# EAGLE design XSensorAdapter (EAGLE 9.5.2)
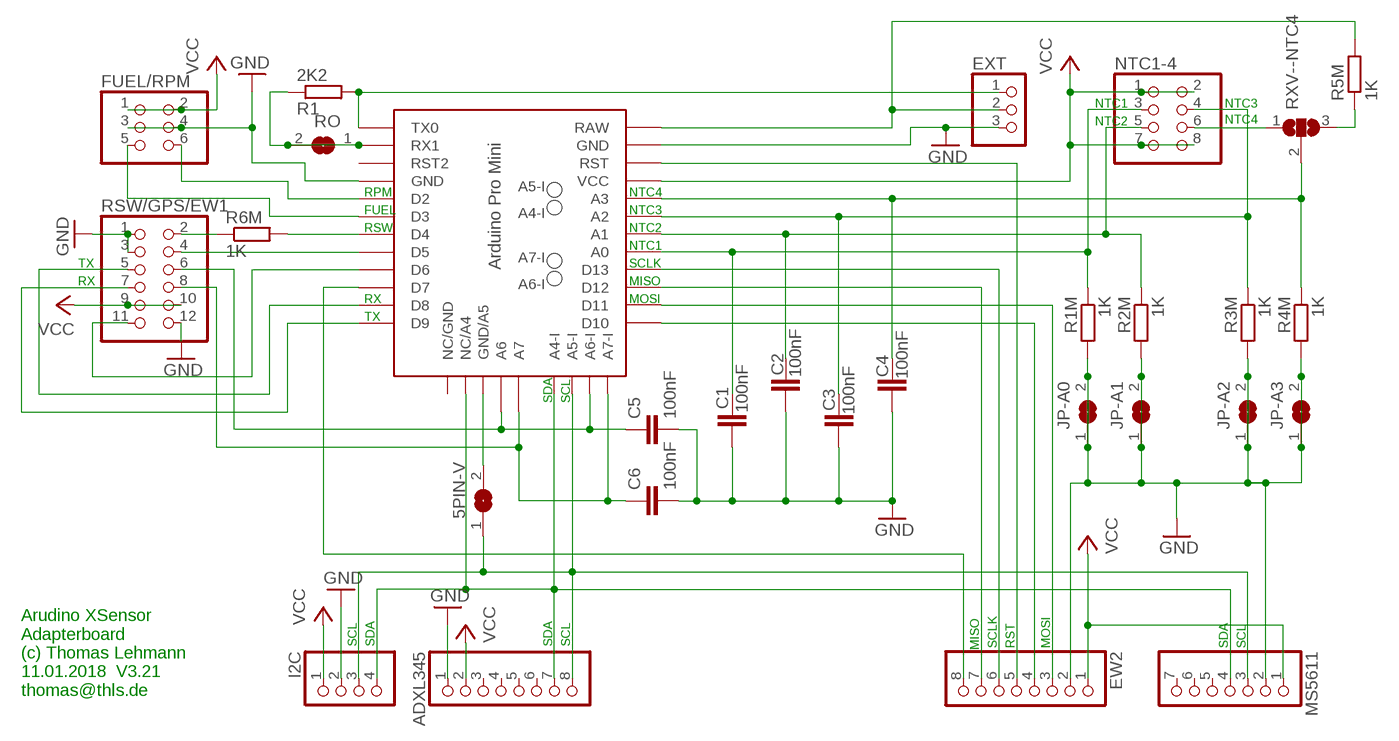
[diagram p0: schematic, sheet 1]

## Parts
5PIN-V  SJ  [SJ]
ADXL345  PINHD-1X8  [1X08]
C1  100nF  C2.5/2  [C2.5-2]
C2  100nF  C2.5/2  [C2.5-2]
C3  100nF  C2.5/2  [C2.5-2]
C4  100nF  C2.5/2  [C2.5-2]
C5  100nF  C2.5/2  [C2.5-2]
C6  100nF  C2.5/2  [C2.5-2]
EW2  PINHD-1X8  [1X08]
EXT  PINHD-1X3  [1X03]
FUEL/RPM  PINHD-2X3  [2X03]
I2C  PINHD-1X4  [1X04]
JP-A0  SJ  [SJ]
JP-A1  SJ  [SJ]
JP-A2  SJ  [SJ]
JP-A3  SJ  [SJ]
MS5611  PINHD-1X7  [1X07]
NTC1-4  PINHD-2X4  [2X04]
R1  2K2  R-EU_0207/10  [0207/10]
R1M  1K  R-EU_0207/10  [0207/10]
R2M  1K  R-EU_0207/10  [0207/10]
R3M  1K  R-EU_0207/10  [0207/10]
R4M  1K  R-EU_0207/10  [0207/10]
R5M  1K  R-EU_0207/10  [0207/10]
R6M  1K  R-EU_0207/10  [0207/10]
RO  SJ  [SJ]
RSW/GPS/EW1  PINHD-2X6  [2X06]
RXV--NTC4  SJ2W  [SJ_2]
U$1  PRO-MINI-5PINPRO-MINI-5PIN  [PRO-MINI-5PIN]

## Nets
GND: ADXL345.1 C1.2 C2.2 C3.2 C4.2 C5.2 C6.2 EW2.2 EXT.3 FUEL/RPM.3 FUEL/RPM.4 I2C.2 JP-A0.1 JP-A0.2 JP-A1.1 JP-A1.2 JP-A2.1 JP-A2.2 JP-A3.1 JP-A3.2 MS5611.2 R1M.2 R2M.2 R3M.2 R4M.2 RSW/GPS/EW1.1 RSW/GPS/EW1.3 RSW/GPS/EW1.12 U$1.GND U$1.GND1(GND)
N$1: C4.1 R4M.1 RXV--NTC4.2 U$1.A3
N$2: EXT.1 R1.2 U$1.TX0
N$3: RSW/GPS/EW1.7 U$1.D9
N$4: R5M.1 RXV--NTC4.3
N$5: C5.1 RSW/GPS/EW1.6 U$1.A6 U$1.A6-I
N$6: RSW/GPS/EW1.4 U$1.D5
N$7: RSW/GPS/EW1.5 U$1.D8
N$9: 5PIN-V.2 U$1.GND/A5
N$10: C1.1 NTC1-4.3 R1M.1 U$1.A0
N$11: FUEL/RPM.6 U$1.D2
N$12: R6M.2 U$1.D4
N$13: ADXL345.7 I2C.4 MS5611.4 U$1.A4-I U$1.NC/A4
N$14: FUEL/RPM.5 U$1.D3
N$15: R6M.1 RSW/GPS/EW1.2
N$18: C6.1 RSW/GPS/EW1.8 U$1.A7 U$1.A7-I
N$19: C2.1 NTC1-4.5 R2M.1 U$1.A1
N$20: C3.1 NTC1-4.4 R3M.1 U$1.A2
N$21: EW2.6 U$1.D13
N$22: EW2.7 U$1.D12
N$23: EW2.3 U$1.D11
N$24: EW2.4 U$1.D10
N$25: EXT.2 R5M.2 U$1.RAW
N$26: RSW/GPS/EW1.11 U$1.D6
N$28: NTC1-4.6 RXV--NTC4.1
N$29: EW2.5 U$1.RST
N$30: EW2.8 U$1.D7
N$31: 5PIN-V.1 ADXL345.8 I2C.3 MS5611.3 U$1.A5-I
N$32: R1.1 RO.1 RO.2 U$1.RX1
VCC: ADXL345.2 EW2.1 FUEL/RPM.1 FUEL/RPM.2 I2C.1 MS5611.1 NTC1-4.1 NTC1-4.2 NTC1-4.7 NTC1-4.8 RSW/GPS/EW1.9 RSW/GPS/EW1.10 U$1.VCC
Unconnected: ADXL345.3 ADXL345.4 ADXL345.5 ADXL345.6 MS5611.5 MS5611.6 MS5611.7 U$1.NC/GND U$1.RST1(RST2)

## Notes on the sheet
- NTC1 | NTC3
- NTC2 | NTC4
- RPM | NTC4
- FUEL | NTC3
- RSW | NTC2
- NTC1
- TX | SCLK
- RX | MISO
- RX | MOSI
- TX
- SDA | SCL
- SCL | SDA | SDA | SCL | SCLK | RST | MOSI | SDA | SCL
- MISO
- Arudino XSensor
  Adapterboard
  (c) Thomas Lehmann
  11.01.2018  V3.21
  thomas@thls.de

## Library data of the parts
5PIN-V JP-A0 JP-A1-JP-A3 RO = jumper:SJ: SMD solder JUMPER
ADXL345 EW2 = pinhead:PINHD-1X8: PIN HEADER
C1-C6 = capacitor-wima:C: CAPACITOR naming: grid - package width
EXT = pinhead:PINHD-1X3: PIN HEADER
FUEL/RPM = pinhead:PINHD-2X3: PIN HEADER
I2C = pinhead:PINHD-1X4: PIN HEADER
MS5611 = pinhead:PINHD-1X7: PIN HEADER
NTC1-4 = pinhead:PINHD-2X4: PIN HEADER
R1 R1M R2M R3M R4M R5M R6M = resistor:R-EU_: RESISTOR, European symbol
RSW/GPS/EW1 = pinhead:PINHD-2X6: PIN HEADER
RXV--NTC4 = jumper:SJ2W: SMD solder JUMPER
U$1 = OwnLib:PRO-MINI-5PIN: unterstützt werden drei Varianten des Arudino Mini Pro Unterseite: 5-Pin Version ohne interne A4-A7 3-Pin Version mit internen A4+A5 0-Pin Version mit internen A4-A7 !! die 0-Pin Version hat eine gespiegelte obere Stiftleiste (FTDI Adapter) !!

## Board
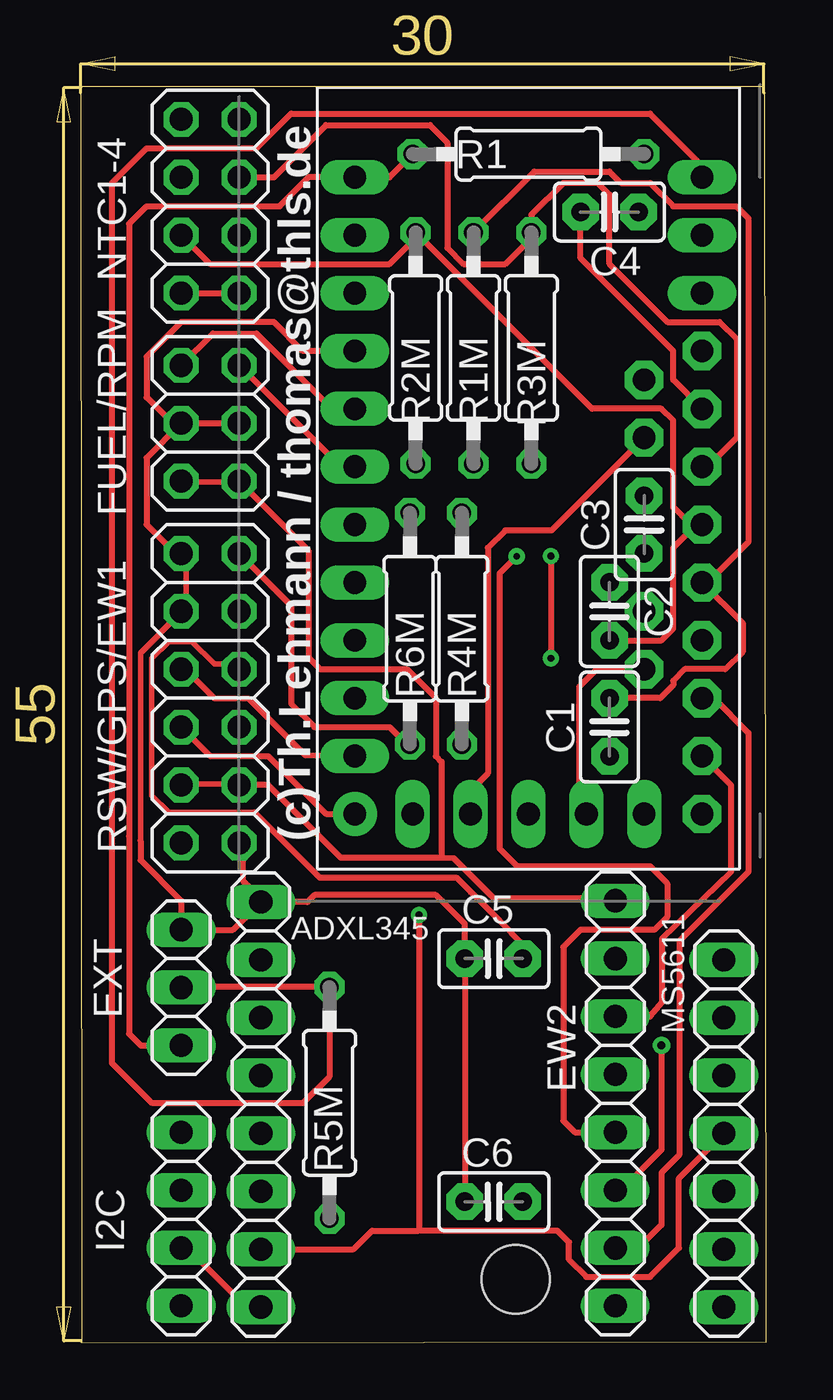
[diagram p1: board, top side]
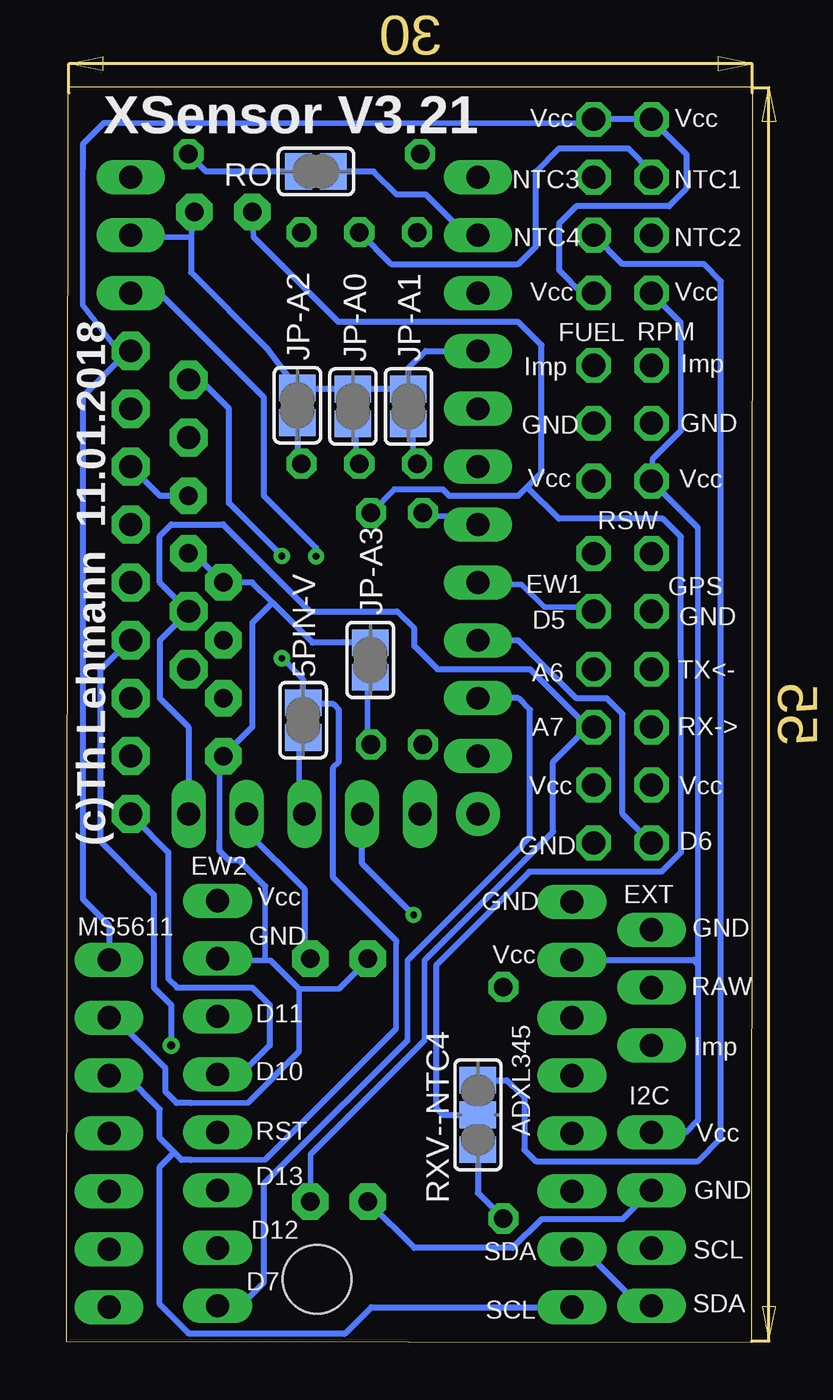
[diagram p2: board, bottom side, seen from below]

Size 30.1 x 55.11 mm. Coordinates in mm from the lower left corner, seen from the top.
Outline: 0.05,0 30.1,0.03 30.02,55.11 0,55.11 0.05,0
Copper layers (1*16): Top 0.035mm / dielectric 1.5mm / Bottom 0.035mm
Design rules "Platinenbelichter *": minimum track width 0.25mm, minimum drill 0.3mm, track to track 0.25mm, track to pad 0.25mm, pad to pad 0.25mm, via to via 0.25mm, smd to smd 6mil, copper to edge 0.25mm, drill to drill 0.25mm, minimum pad ring 10mil, minimum via ring 8mil, stop-mask expansion 4mil, vias tented up to drill 0mil, thermal gap 10mil
Holes 3 mm at 19.1,2.78

### Footprints (pad centres in the part's own frame; a part is rotated, then mirrored left to right if it is on the bottom)
SJ = smd 1.168 x 1.6: 1 -0.762,0; 2 0.762,0
1X08 = drill 1.016 long: 1 -8.89,0; 2 -6.35,0; 3 -3.81,0; 4 -1.27,0; 5 1.27,0; 6 3.81,0; 7 6.35,0; 8 8.89,0
C2.5-2 = drill 0.813 pad 1.6 octagon: 1 -1.27,0; 2 1.27,0
1X03 = drill 1.016 long: 1 -2.54,0; 2 0,0; 3 2.54,0
2X03 = drill 1.016 octagon: 1 -2.54,-1.27; 2 -2.54,1.27; 3 0,-1.27; 4 0,1.27; 5 2.54,-1.27; 6 2.54,1.27
1X04 = drill 1.016 long: 1 -3.81,0; 2 -1.27,0; 3 1.27,0; 4 3.81,0
1X07 = drill 1.016 long: 1 -7.62,0; 2 -5.08,0; 3 -2.54,0; 4 0,0; 5 2.54,0; 6 5.08,0; 7 7.62,0
2X04 = drill 1.016 octagon: 1 -3.81,-1.27; 2 -3.81,1.27; 3 -1.27,-1.27; 4 -1.27,1.27; 5 1.27,-1.27; 6 1.27,1.27; 7 3.81,-1.27; 8 3.81,1.27
0207/10 = drill 0.813 octagon: 1 -5.08,0; 2 5.08,0
2X06 = drill 1.016 octagon: 1 -6.35,-1.27; 2 -6.35,1.27; 3 -3.81,-1.27; 4 -3.81,1.27; 5 -1.27,-1.27; 6 -1.27,1.27; 7 1.27,-1.27; 8 1.27,1.27; 9 3.81,-1.27; 10 3.81,1.27; 11 6.35,-1.27; 12 6.35,1.27
SJ_2 = smd 1.168 x 1.6: 1 -1.524,0; 2 0,0; 3 1.524,0
PRO-MINI-5PIN = drill 1 pad 1.676 octagon: A0 8.89,8.89; A1 8.89,11.43; A2 8.89,13.97; A3 8.89,16.51; A4-I 6.35,15.24; A5-I 6.35,17.78; A6-I 6.35,5.08; A7-I 6.35,7.62; D10 8.89,-1.27; D11 8.89,1.27; D12 8.89,3.81; D13 8.89,6.35; VCC 8.89,19.05 | drill 1 long: A6 3.81,-1.27; A7 6.35,-1.27; D2 -6.35,16.51; D3 -6.35,13.97; D4 -6.35,11.43; D5 -6.35,8.89; D6 -6.35,6.35; D7 -6.35,3.81; D8 -6.35,1.27; GND 8.89,24.13; GND1 -6.35,19.05; GND/A5 1.27,-1.27; NC/A4 -1.27,-1.27; NC/GND -3.81,-1.27; RAW 8.89,26.67; RST 8.89,21.59; RST1 -6.35,21.59; RX1 -6.35,24.13; TX0 -6.35,26.67 | drill 1 pad 1.93: D9 -6.35,-1.27

### Placement (x,y rotation side)
5PIN-V  19.71,27.31 270 bottom
ADXL345  7.91,10.44 270 top
C1  23.22,27.01 270 top
C2  23.22,32.09 90 top
C3  24.74,35.9 270 top
C4  23.22,49.61 0 top
C5  18.14,16.85 180 top
C6  18.14,6.18 180 top
EW2  23.47,10.5 270 top
EXT  4.42,15.58 90 top
FUEL/RPM  5.69,40.34 90 top
I2C  4.42,5.42 270 top
JP-A0  17.53,41.08 270 bottom
JP-A1  15.09,41.08 270 bottom
JP-A2  19.96,41.13 270 bottom
JP-A3  16.76,29.95 270 bottom
MS5611  28.23,9.17 270 top
NTC1-4  5.69,49.87 270 top
R1  19.66,52.15 180 top
R1M  17.25,43.64 270 top
R2M  14.71,43.64 270 top
R3M  19.79,43.64 270 top
R4M  16.74,31.32 270 top
R5M  10.92,10.52 90 top
R6M  14.45,31.32 90 top
RO  19.15,51.39 180 bottom
RSW/GPS/EW1  5.69,28.28 270 top
RXV--NTC4  12.04,9.99 270 bottom
U$1  18.39,24.47 0 top

### Tracks (layer width: path | path; a pad name or v marks a point on that pad's centre or on a via)
GND
  Top 0.25: RSW/GPS/EW1.12 7.13,21.77 7.13,20.27 7.88,19.52 ADXL345.1 | RSW/GPS/EW1.1 4.63,34.52 4.63,32.27 RSW/GPS/EW1.3 4.38,32.02 2.63,30.27 2.63,22.02
  Top 0.254: FUEL/RPM.4 2.9,38.82 2.9,35.9 4.17,34.63 RSW/GPS/EW1.1 | FUEL/RPM.4 FUEL/RPM.3 | FUEL/RPM.4 4.04,40.34 2.9,41.48 2.9,43.26 4.42,44.79 8.48,44.79 9.75,43.52 U$1.GND1 | 2.63,22.02 2.63,21.18 4.42,19.39 EXT.3 6.69,18.12 ADXL345.1 9.96,19.33 10.26,19.64 15.6,19.64 16.87,18.37 C5.2 C6.2
  Bottom 0.25: 21.38,16.77 21.13,16.77 19.88,15.52 | 21.38,16.77 23.38,16.77 EW2.2 | 19.88,15.52 18.13,15.52 16.88,16.77 C5.2 | 24.63,10.52 22.13,10.52 19.88,12.77 19.88,15.52 | 21.38,16.77 21.38,20.02 | 23.38,22.02 23.38,25.52 C1.2 | U$1.GND 27.13,48.52 24.63,48.52 C4.2 | 15.13,41.98 JP-A1.1 | 17.38,41.98 JP-A0.1 17.63,41.98 | 19.88,41.98 JP-A2.1 20.06,41.94 20.13,41.98 | JP-A0.2 17.38,40.23 17.38,38.77 R1M.2 | JP-A1.2 14.88,40.23 14.88,38.77 R2M.2 | 19.88,40.23 JP-A2.2 | JP-A3.2 16.88,29.02 16.88,26.27 R4M.2
  Bottom 0.254: 21.38,20.02 22.53,21.17 22.96,21.17 23.38,21.58 23.38,22.02 | 24.63,10.52 25.27,10.52 25.76,11 25.76,12.02 27.99,14.25 MS5611.2 | 21.06,32.47 19.3,30.71 JP-A3.1 JP-A3.2 | 21.06,32.47 21.95,33.36 C2.2 24.49,34.63 C3.2 | JP-A1.1 JP-A0.1 | JP-A0.1 19.96,41.84 | 19.96,41.84 20.06,41.94 | 24.63,48.52 24.63,46.96 21.29,43.62 19.96,41.84 | C1.2 21.95,27.01 21.95,31.58 21.06,32.47 | JP-A1.1 15.09,42.75 14.33,43.52 U$1.GND1 | I2C.2 5.69,5.42 9.25,5.42 10.52,4.15 14.83,4.15 C6.2 | 19.95,40.35 JP-A2.2 | JP-A2.2 19.96,38.74 R3M.2 | JP-A1.1 JP-A1.2 | JP-A0.1 JP-A0.2 | JP-A2.1 JP-A2.2
N$1
  Top 0.254: U$1.A3 26.01,42.25 26.01,43.52 21.95,47.58 C4.1
  Bottom 0.25: 20.63,47.27 21.88,48.52 C4.1 | 3.13,30.02 3.13,21.52
  Bottom 0.254: R4M.1 15.7,37.44 13.58,37.44 13.31,37.17 10.26,37.17 9.88,37.55 | 9.88,37.55 9.25,38.18 9.25,43.77 10.26,44.79 18.15,44.79 20.63,47.27 | 3.13,30.02 3.13,35.37 3.91,36.15 8.48,36.15 9.88,37.55 | 3.13,21.52 3.99,20.66 9.78,20.66 13.88,16.56 13.88,10.3 13.56,9.99 RXV--NTC4.2
N$2
  Top 0.254: R1.2 13.56,51.14 U$1.TX0 10.01,51.14 8.74,49.87 2.9,49.87 2.13,49.1 2.13,22.23 2.13,13.55 2.64,13.04 EXT.1
N$3
  Top 0.254: RSW/GPS/EW1.7 5.69,25.74 8.23,25.74 10.77,23.2 U$1.D9
N$4
  Bottom 0.254: RXV--NTC4.3 12.04,6.56 R5M.1
N$5
  Top 0.25: 7.63,23.27 3.88,23.27 3.13,24.02 3.13,30.02 3.88,30.77 4.88,30.77 5.88,29.77 6.88,29.77 RSW/GPS/EW1.6 | 17.13,19.77 18.38,18.52 | U$1.A6 21.88,23.52 21.88,28.77 22.63,29.52 24.63,29.52 U$1.A6-I
  Top 0.254: 18.38,18.52 19.41,17.49 C5.1 | 7.63,23.27 10.49,20.4 16.49,20.4 17.13,19.77
  Bottom 0.254: U$1.A6 22.2,22.43 19.66,19.89 19.66,17.1 C5.1
N$6
  Bottom 0.25: U$1.D5 11.88,33.27 10.13,33.27 9.13,32.27 7.13,32.27 RSW/GPS/EW1.4
N$7
  Top 0.25: U$1.D8 11.88,25.77 9.88,25.77 7.38,28.27 5.88,28.27 4.63,29.52 RSW/GPS/EW1.5
N$9
  Bottom 0.25: 5PIN-V.2 19.88,26.52 19.88,23.27 U$1.GND/A5
N$10
  Top 0.254: C1.1 25.44,28.28 26.01,28.84 26.01,29.04 26.52,29.55 28.3,29.55 29.06,30.31 29.06,31.58 U$1.A0 27.53,33.36 29.31,35.14 29.31,49.34 28.78,49.87 26.01,49.87 24.99,50.88 23.72,50.88 23.22,51.39 19.91,51.39 R1M.1
  Bottom 0.254: R1M.1 15.85,47.33 10.26,47.33 9.5,48.09 9.5,51.39 8.48,52.41 5.44,52.41 4.42,51.39 NTC1-4.3
N$11
  Top 0.254: FUEL/RPM.6 5.82,44.28 7.72,44.28 11.02,40.98 U$1.D2
N$12
  Bottom 0.25: R6M.2 14.38,36.27 12.38,36.27 12.13,36.02 U$1.D4
N$13  (via drill 0.3)
  Top 0.254: U$1.A4-I 20.68,35.64 18.64,35.64 17.88,34.88 17.88,24.97 17.12,24.21 U$1.NC/A4 | MS5611.4 26.26,7.21 26.26,4.15 24.99,2.88 22.2,2.88 21.44,3.64 21.44,4.4 20.93,4.91 14.83,4.91 | 14.83,4.91 12.8,4.91 11.99,4.09 ADXL345.7 | v14.86,18.76 14.86,4.93 14.83,4.91
  Bottom 0.254: I2C.4 4.93,1.61 7.42,4.09 ADXL345.7 | v14.86,18.76 17.12,21.02 U$1.NC/A4
N$14
  Top 0.254: FUEL/RPM.5 11.4,38.44 U$1.D3
N$15
  Top 0.254: RSW/GPS/EW1.2 9.25,32.34 9.25,28.02 10.26,27.01 13.56,27.01 14.33,26.25 R6M.1
N$18
  Bottom 0.25: 24.63,32.02 U$1.A7-I | 9.38,21.77 14.38,16.77 14.38,13.27 19.38,8.27 19.38,6.27 C6.1
  Bottom 0.254: U$1.A7 24.74,27.01 26.01,28.28 26.01,30.82 U$1.A7-I 26.01,33.36 26.01,35.39 25.5,35.9 23.22,35.9 19.41,32.09 15.6,32.09 14.83,31.32 14.83,30.56 13.82,29.55 9.75,29.55 7.21,27.01 | 9.38,21.77 8.74,22.41 8.74,25.48 7.21,27.01 | 7.21,27.01 RSW/GPS/EW1.8
N$19
  Top 0.254: NTC1-4.5 5.69,47.33 13.56,47.33 14.71,48.47 R2M.1 22.45,40.98 25.5,40.98 26.01,40.47 26.01,36.66 26.77,35.9 U$1.A1 27.03,35.9 26.01,34.88 26.01,31.32 25.5,30.82 C2.1
N$20
  Top 0.254: U$1.A2 27.53,38.44 28.8,39.71 28.8,44.02 28.04,44.79 25.76,44.79 23.22,47.33 23.22,50.38 22.71,50.88 21.18,50.88 19.79,49.49 R3M.1 19.79,48.47 18.64,47.33 16.82,47.33 16.1,48.04 16.1,52.66 15.34,53.42 10.77,53.42 8.48,51.14 NTC1-4.4
  Bottom 0.254: U$1.A2 26.01,37.17 C3.1
N$21  (via drill 0.35)
  Top 0.254: v25.5,13.04 25.5,8.46 23.72,6.69 EW2.6
  Bottom 0.25: 28.63,29.52 27.38,30.77 U$1.D13
  Bottom 0.254: v25.5,13.04 25.5,14.82 26.26,15.58 26.26,19.65 28.63,22.02 28.63,29.52
N$22
  Top 0.25: 23.63,4.27 EW2.7
  Top 0.254: U$1.D12 27.79,28.28 29.31,26.75 29.31,20.66 26.28,17.62 26.28,8.23 25.5,7.45 25.5,5.16 24.49,4.15 EW2.7
N$23
  Top 0.254: EW2.3 24.99,14.31 25.52,14.93 25.52,17.73 28.55,20.66 28.55,24.47 U$1.D11
N$24
  Bottom 0.25: 25.63,21.52 27.13,23.02 U$1.D10
  Bottom 0.254: 25.63,21.52 25.63,15.96 25.25,15.58 21.95,15.58 21.18,14.82 21.18,13.04 22.45,11.77 EW2.4
N$25
  Top 0.254: U$1.RAW 27.28,51.64 24.99,53.93 9.25,53.93 7.72,52.41 2.9,52.41 1.38,50.89 1.38,12.27 3.15,10.5 9.75,10.5 10.92,11.66 R5M.2 4.44,15.6 EXT.2
N$26
  Bottom 0.254: U$1.D6 10.26,30.82 7.71,28.27 6.38,28.27 5.69,27.58 5.69,23.2 RSW/GPS/EW1.11
N$28
  Bottom 0.254: RXV--NTC4.1 10.77,11.51 10.52,11.26 10.01,10.75 10.01,8.46 9.5,7.96 2.39,7.96 1.37,8.97 1.37,46.56 2.13,47.33 5.69,47.33 NTC1-4.6
N$29  (via drill 0.3)
  Top 0.254: v19.14,34.5 18.39,33.75 18.39,21.67 19.15,20.91 24.99,20.91 25.76,20.15 25.76,18.68 25.2,18.12 21.95,18.12 21.18,17.36 21.18,9.73 21.69,9.23 EW2.5
  Bottom 0.254: U$1.RST 26.01,46.06 21.44,41.48 21.44,37.17 19.14,34.87 v19.14,34.5
N$30
  Bottom 0.25: 10.13,21.77 15.13,16.77 15.13,13.27 20.63,7.77
  Bottom 0.254: 10.13,21.77 10.13,21.8 9.75,22.18 9.75,27.77 10.26,28.28 U$1.D7 | EW2.8 22.45,1.61 21.44,2.62 21.44,6.96 20.63,7.77
N$31  (via drill 0.3)
  Top 0.254: ADXL345.8 7.86,1.61 7.21,1.61 4.67,4.15 I2C.3 | v20.65,34.52 v20.65,30.03
  Bottom 0.25: 15.63,17.52 15.63,13.77 21.38,8.02 24.63,8.02 | 19.63,28.02 5PIN-V.1 19.63,28.27
  Bottom 0.254: v20.65,34.52 22.96,36.84 22.96,40.98 24.23,42.25 U$1.A5-I | 15.63,17.52 15.63,17.64 18.39,20.4 18.39,25.23 18.14,25.48 18.14,27.77 18.38,28.02 19.63,28.02 | 24.63,8.02 25.05,8.02 25.37,8.34 | 25.37,8.34 26.01,8.97 26.01,10.24 27.53,11.77 28.18,11.77 MS5611.3 | 25.37,8.34 26.01,7.7 26.01,1.67 24.74,0.4 17.94,0.4 17.94,0.39 17.88,0.39 16.72,1.55 ADXL345.8 | 20.17,28.02 5PIN-V.1 | 20.17,28.12 5PIN-V.1 | 5PIN-V.1 19.71,29.09 v20.65,30.03
N$32
  Bottom 0.254: U$1.RX1 12.8,48.6 12.8,48.85 14.33,50.38 15.6,50.38 16.61,51.39 RO.1 RO.2 23.98,51.39 R1.1
VCC
  Top 0.25: RSW/GPS/EW1.9 4.63,24.52 6.88,24.52 RSW/GPS/EW1.10 7.13,24.52 | 15.85,21.27 16.38,21.27 18.13,19.52 23.38,19.52 EW2.1 | FUEL/RPM.2 4.63,37.77 6.88,37.77 FUEL/RPM.1 7.13,37.77
  Top 0.254: NTC1-4.7 NTC1-4.8 | FUEL/RPM.1 10.01,34.75 10.01,30.05 10.52,29.55 14.33,29.55 15.6,28.28 15.6,25.74 15.85,25.48 15.85,21.27 11.43,21.27 8.23,24.47 RSW/GPS/EW1.10
  Bottom 0.25: 27.63,43.26 29.38,41.51 | NTC1-4.7 3.13,44.77 3.13,40.02 4.38,38.77 4.38,38.02 FUEL/RPM.2 4.38,37.77 2.38,35.77 2.38,17.77 | 4.38,53.52 NTC1-4.1 | 27.63,43.26 29.38,45.52 29.38,51.52 | 27.38,53.52 7.13,53.52 NTC1-4.2 | 27.63,43.26 U$1.VCC
  Bottom 0.254: NTC1-4.2 NTC1-4.1 2.9,52.15 2.9,50.63 3.66,49.87 7.72,49.87 8.48,49.1 8.48,47.07 7.47,46.06 NTC1-4.8 | 27.38,53.52 28.46,53.52 29.38,52.59 29.38,51.52 | ADXL345.2 2.58,16.79 2.38,16.59 | 2.38,17.77 2.38,16.59 | 2.38,16.59 2.38,9.74 2.9,9.23 I2C.1 | 29.38,41.51 29.38,19.46 28.23,18.31 MS5611.1

### Text on the board
tNames: (c)Th.Lehmann / thomas@thls.de
bNames: Vcc | Vcc | XSensor V3.21 | NTC1 | NTC3 | NTC2 | NTC4 | Vcc | Vcc | (c)Th.Lehmann 11.01.2018 | RPM | FUEL | Imp | Imp | GND | GND | Vcc | Vcc | RSW | GPS | EW1 | GND | D5 | TX<- | A6 | RX-> | A7 | Vcc | Vcc | D6 | GND | EW2 | EXT | GND | Vcc | GND | MS5611 | Vcc | GND | RAW | ADXL345 | D11 | Imp | D10 | I2C | Vcc | RST | D13 | GND | D12 | SCL | SDA | D7 | SDA | SCL